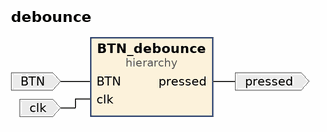
[diagram p0: block diagram of the top level]
# Vivado block design debounce, xc7a35tcpg236-1, Vivado 2018.3
create_bd_design debounce

create_bd_port -dir I BTN
create_bd_port -dir I -type clk clk
create_bd_port -dir O -type data pressed

create_bd_cell -type hier BTN_debounce

# ---- hierarchy /BTN_debounce ----
current_bd_instance /BTN_debounce
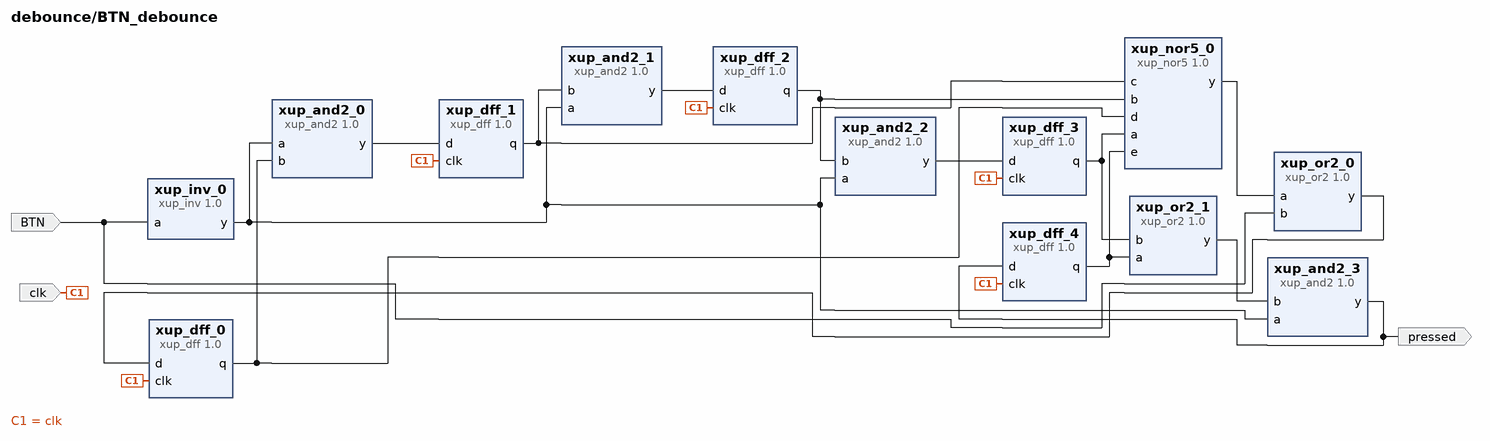
[diagram p1: block diagram inside /BTN_debounce]
create_bd_pin -dir I clk
create_bd_pin -dir O pressed
create_bd_pin -dir I BTN

create_bd_cell -type ip -vlnv xilinx.com:xup:xup_dff:1.0 xup_dff_1
set_property -dict {CONFIG.DELAY 0} [get_bd_cells xup_dff_1]
create_bd_cell -type ip -vlnv xilinx.com:xup:xup_or2:1.0 xup_or2_1
set_property -dict {CONFIG.DELAY 0} [get_bd_cells xup_or2_1]
create_bd_cell -type ip -vlnv xilinx.com:xup:xup_dff:1.0 xup_dff_2
set_property -dict {CONFIG.DELAY 0} [get_bd_cells xup_dff_2]
create_bd_cell -type ip -vlnv xilinx.com:xup:xup_dff:1.0 xup_dff_3
set_property -dict {CONFIG.DELAY 0} [get_bd_cells xup_dff_3]
create_bd_cell -type ip -vlnv xilinx.com:xup:xup_dff:1.0 xup_dff_4
set_property -dict {CONFIG.DELAY 0} [get_bd_cells xup_dff_4]
create_bd_cell -type ip -vlnv xilinx.com:xup:xup_inv:1.0 xup_inv_0
create_bd_cell -type ip -vlnv xilinx.com:xup:xup_and2:1.0 xup_and2_0
set_property -dict {CONFIG.DELAY 0} [get_bd_cells xup_and2_0]
create_bd_cell -type ip -vlnv xilinx.com:xup:xup_and2:1.0 xup_and2_1
set_property -dict {CONFIG.DELAY 0} [get_bd_cells xup_and2_1]
create_bd_cell -type ip -vlnv xilinx.com:xup:xup_nor5:1.0 xup_nor5_0
set_property -dict {CONFIG.DELAY 0} [get_bd_cells xup_nor5_0]
create_bd_cell -type ip -vlnv xilinx.com:xup:xup_and2:1.0 xup_and2_2
set_property -dict {CONFIG.DELAY 0} [get_bd_cells xup_and2_2]
create_bd_cell -type ip -vlnv xilinx.com:xup:xup_dff:1.0 xup_dff_0
set_property -dict {CONFIG.DELAY 0} [get_bd_cells xup_dff_0]
create_bd_cell -type ip -vlnv xilinx.com:xup:xup_or2:1.0 xup_or2_0
set_property -dict {CONFIG.DELAY 0} [get_bd_cells xup_or2_0]
create_bd_cell -type ip -vlnv xilinx.com:xup:xup_and2:1.0 xup_and2_3
set_property -dict {CONFIG.DELAY 0} [get_bd_cells xup_and2_3]

# ---- connections ----

current_bd_instance /BTN_debounce
connect_bd_net [get_bd_pins xup_and2_0/y] [get_bd_pins xup_dff_1/d]
connect_bd_net [get_bd_pins xup_dff_1/q] [get_bd_pins xup_and2_1/b] [get_bd_pins xup_nor5_0/c]
connect_bd_net [get_bd_pins xup_dff_4/q] [get_bd_pins xup_or2_1/a] [get_bd_pins xup_nor5_0/e]
connect_bd_net [get_bd_pins xup_dff_3/q] [get_bd_pins xup_or2_1/b] [get_bd_pins xup_nor5_0/a]
connect_bd_net [get_bd_pins xup_or2_1/y] [get_bd_pins xup_and2_3/b]
connect_bd_net [get_bd_pins xup_and2_1/y] [get_bd_pins xup_dff_2/d]
connect_bd_net [get_bd_pins xup_dff_2/q] [get_bd_pins xup_and2_2/b] [get_bd_pins xup_nor5_0/b]
connect_bd_net [get_bd_pins xup_and2_2/y] [get_bd_pins xup_dff_3/d]
connect_bd_net [get_bd_pins xup_inv_0/y] [get_bd_pins xup_and2_0/a] [get_bd_pins xup_and2_2/a] [get_bd_pins xup_and2_1/a] [get_bd_pins xup_and2_3/a]
connect_bd_net [get_bd_pins xup_dff_0/q] [get_bd_pins xup_and2_0/b] [get_bd_pins xup_nor5_0/d]
connect_bd_net [get_bd_pins xup_nor5_0/y] [get_bd_pins xup_or2_0/a]
connect_bd_net [get_bd_pins xup_or2_0/y] [get_bd_pins xup_dff_0/d]
connect_bd_net [get_bd_pins clk] \
  [get_bd_pins xup_dff_2/clk] [get_bd_pins xup_dff_3/clk] [get_bd_pins xup_dff_4/clk] [get_bd_pins xup_dff_0/clk] \
  [get_bd_pins xup_dff_1/clk]
connect_bd_net [get_bd_pins xup_and2_3/y] [get_bd_pins pressed] [get_bd_pins xup_dff_4/d]
connect_bd_net [get_bd_pins BTN] [get_bd_pins xup_or2_0/b] [get_bd_pins xup_inv_0/a]

current_bd_instance /
connect_bd_net [get_bd_ports BTN] [get_bd_pins BTN_debounce/BTN]
connect_bd_net -net xup_and2_3_y [get_bd_pins BTN_debounce/pressed] [get_bd_ports pressed]
connect_bd_net [get_bd_ports clk] [get_bd_pins BTN_debounce/clk]

validate_bd_design
save_bd_design
